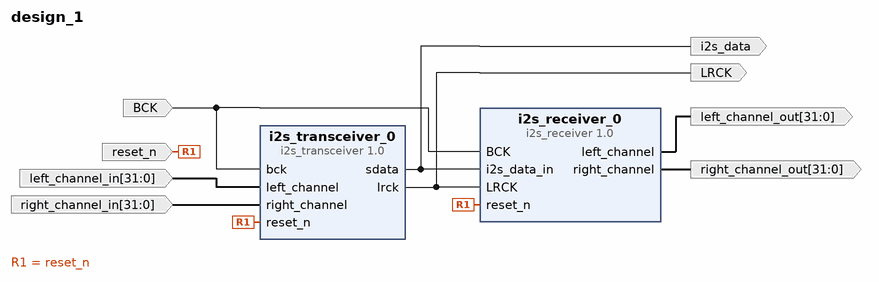
[diagram p0: block diagram of the top level]
# Vivado block design design_1, xc7z010clg400-1, Vivado 2021.1
create_bd_design design_1

create_bd_port -dir I -type rst reset_n
create_bd_port -dir I BCK
create_bd_port -dir O -from 31 -to 0 -type data left_channel_out
create_bd_port -dir O -from 31 -to 0 -type data right_channel_out
create_bd_port -dir I -from 31 -to 0 -type data left_channel_in
create_bd_port -dir I -from 31 -to 0 -type data right_channel_in
create_bd_port -dir O -type clk LRCK
create_bd_port -dir O -type data i2s_data

create_bd_cell -type ip -vlnv xilinx.com:user:i2s_receiver:1.0 i2s_receiver_0
create_bd_cell -type ip -vlnv xilinx.com:user:i2s_transceiver:1.0 i2s_transceiver_0

# ---- connections ----

connect_bd_net [get_bd_ports BCK] [get_bd_pins i2s_receiver_0/BCK] [get_bd_pins i2s_transceiver_0/bck]
connect_bd_net [get_bd_pins i2s_receiver_0/left_channel] [get_bd_ports left_channel_out]
connect_bd_net [get_bd_pins i2s_receiver_0/right_channel] [get_bd_ports right_channel_out]
connect_bd_net [get_bd_pins i2s_transceiver_0/lrck] [get_bd_ports LRCK] [get_bd_pins i2s_receiver_0/LRCK]
connect_bd_net [get_bd_pins i2s_transceiver_0/sdata] [get_bd_ports i2s_data] [get_bd_pins i2s_receiver_0/i2s_data_in]
connect_bd_net [get_bd_ports left_channel_in] [get_bd_pins i2s_transceiver_0/left_channel]
connect_bd_net [get_bd_ports reset_n] [get_bd_pins i2s_receiver_0/reset_n] [get_bd_pins i2s_transceiver_0/reset_n]
connect_bd_net [get_bd_ports right_channel_in] [get_bd_pins i2s_transceiver_0/right_channel]

validate_bd_design
save_bd_design
